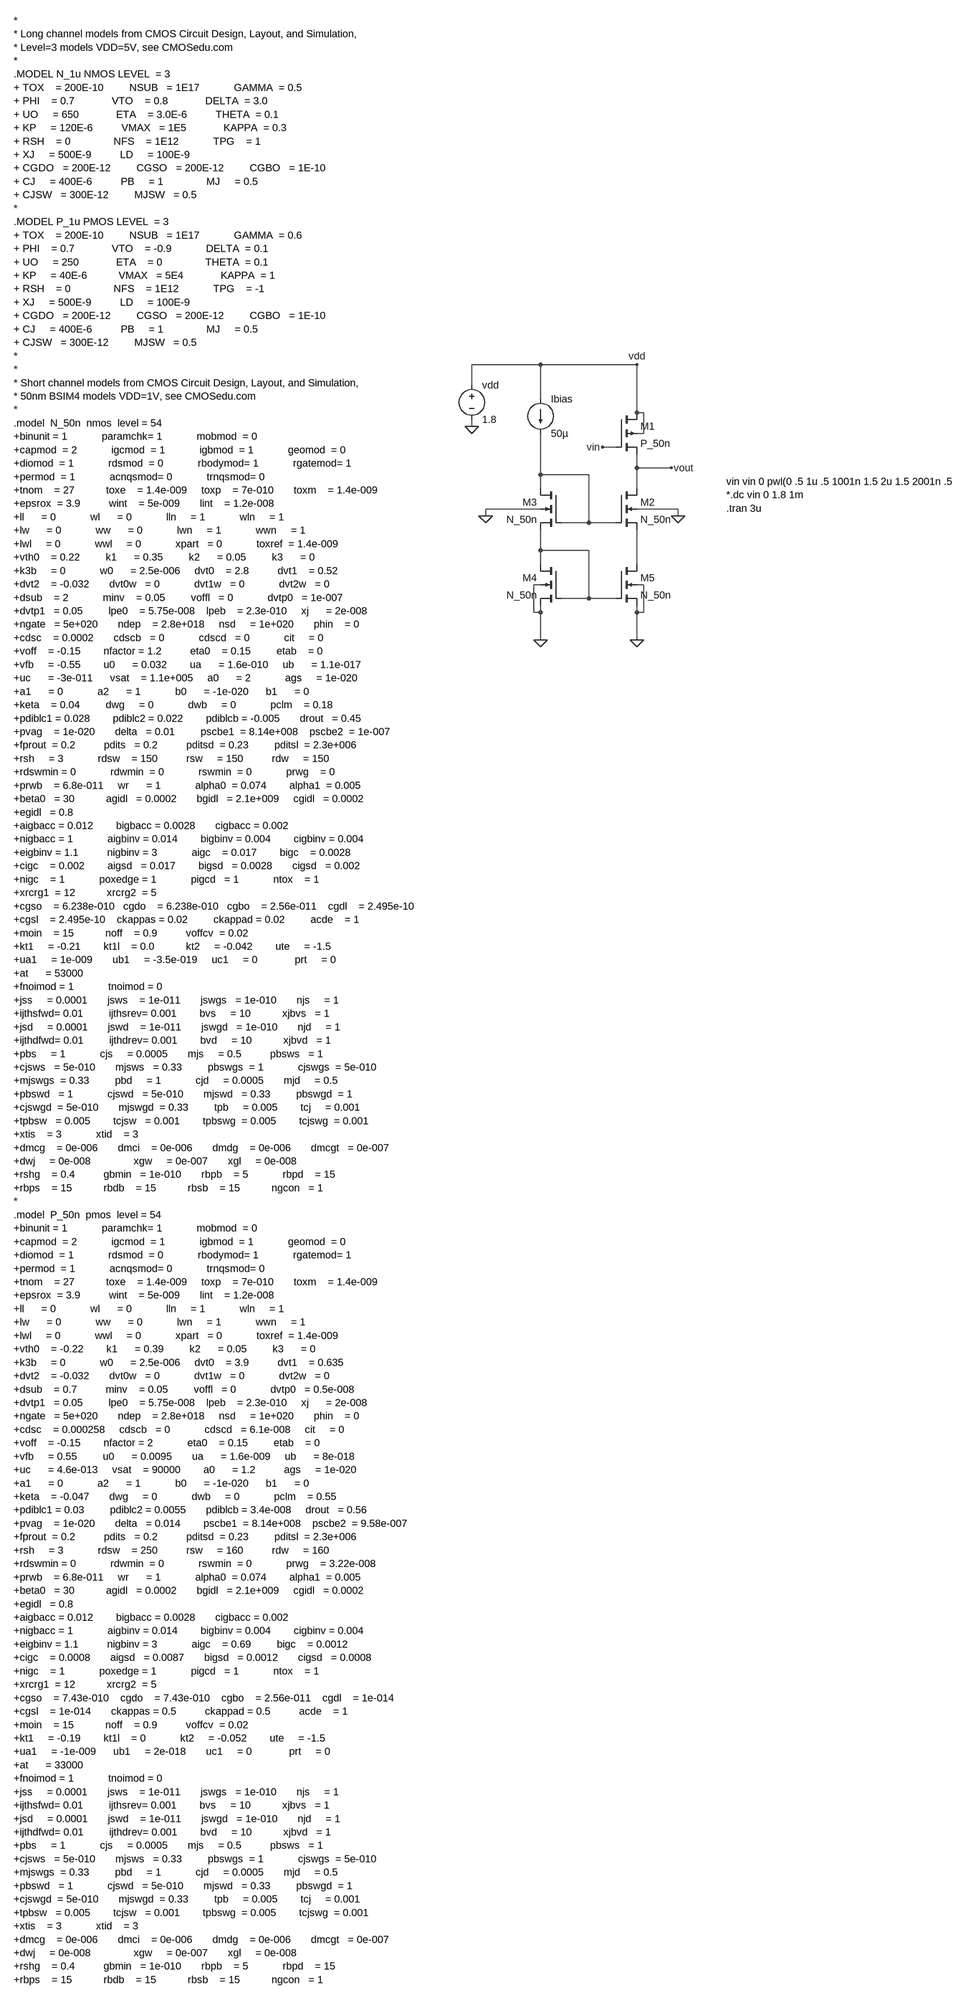
[diagram p0: schematic cascode-ac.asc]
cascode-ac.asc, the LTspice schematic file:
Version 4
SHEET 1 1216 3272
WIRE 48 -32 -112 -32
WIRE 272 -32 48 -32
WIRE -112 16 -112 -32
WIRE 48 48 48 -32
WIRE 272 80 272 -32
WIRE 288 80 272 80
WIRE -112 112 -112 96
WIRE 288 128 288 80
WIRE 288 128 272 128
WIRE 224 160 192 160
WIRE 272 208 272 176
WIRE 352 208 272 208
WIRE 48 224 48 128
WIRE 160 224 48 224
WIRE 48 256 48 224
WIRE 272 256 272 208
WIRE 48 304 -80 304
WIRE 368 304 272 304
WIRE -80 320 -80 304
WIRE 368 320 368 304
WIRE 160 336 160 224
WIRE 160 336 96 336
WIRE 224 336 160 336
WIRE 48 400 48 352
WIRE 160 400 48 400
WIRE 48 432 48 400
WIRE 272 432 272 352
WIRE 48 480 32 480
WIRE 288 480 272 480
WIRE 160 512 160 400
WIRE 160 512 96 512
WIRE 224 512 160 512
WIRE 32 544 32 480
WIRE 48 544 48 528
WIRE 48 544 32 544
WIRE 272 544 272 528
WIRE 288 544 288 480
WIRE 288 544 272 544
WIRE 48 608 48 544
WIRE 272 608 272 544
FLAG 48 608 0
FLAG 272 608 0
FLAG 352 208 vout
FLAG 272 -32 vdd
FLAG 192 160 vin
FLAG -112 112 0
FLAG 368 320 0
FLAG -80 320 0
SYMBOL pmos4 224 80 R0
SYMATTR InstName M1
SYMATTR Value P_50n
SYMBOL nmos4 224 256 R0
SYMATTR InstName M2
SYMATTR Value N_50n
SYMBOL nmos4 96 256 M0
SYMATTR InstName M3
SYMATTR Value N_50n
SYMBOL nmos4 96 432 M0
SYMATTR InstName M4
SYMATTR Value N_50n
SYMBOL nmos4 224 432 R0
SYMATTR InstName M5
SYMATTR Value N_50n
SYMBOL voltage -112 0 R0
SYMATTR InstName vdd
SYMATTR Value 1.8
SYMBOL current 48 48 R0
WINDOW 123 0 0 Left 2
WINDOW 39 0 0 Left 2
SYMATTR InstName Ibias
SYMATTR Value 50µ
TEXT -1528 -832 Left 2 !*\n* Long channel models from CMOS Circuit Design, Layout, and Simulation,\n* Level=3 models VDD=5V, see CMOSedu.com\n*                                                                   \n.MODEL N_1u NMOS LEVEL  = 3                  \n+ TOX    = 200E-10         NSUB   = 1E17            GAMMA  = 0.5          \n+ PHI    = 0.7             VTO    = 0.8             DELTA  = 3.0         \n+ UO     = 650             ETA    = 3.0E-6          THETA  = 0.1          \n+ KP     = 120E-6          VMAX   = 1E5             KAPPA  = 0.3                \n+ RSH    = 0               NFS    = 1E12            TPG    = 1                  \n+ XJ     = 500E-9          LD     = 100E-9                 \n+ CGDO   = 200E-12         CGSO   = 200E-12         CGBO   = 1E-10              \n+ CJ     = 400E-6          PB     = 1               MJ     = 0.5           \n+ CJSW   = 300E-12         MJSW   = 0.5                                  \n*                                                                               \n.MODEL P_1u PMOS LEVEL  = 3                  \n+ TOX    = 200E-10         NSUB   = 1E17            GAMMA  = 0.6          \n+ PHI    = 0.7             VTO    = -0.9            DELTA  = 0.1          \n+ UO     = 250             ETA    = 0               THETA  = 0.1         \n+ KP     = 40E-6           VMAX   = 5E4             KAPPA  = 1         \n+ RSH    = 0               NFS    = 1E12            TPG    = -1                 \n+ XJ     = 500E-9          LD     = 100E-9               \n+ CGDO   = 200E-12         CGSO   = 200E-12         CGBO   = 1E-10              \n+ CJ     = 400E-6          PB     = 1               MJ     = 0.5                \n+ CJSW   = 300E-12         MJSW   = 0.5   \n*\n*\n* Short channel models from CMOS Circuit Design, Layout, and Simulation,\n* 50nm BSIM4 models VDD=1V, see CMOSedu.com\n*\n.model  N_50n  nmos  level = 54\n+binunit = 1            paramchk= 1            mobmod  = 0          \n+capmod  = 2            igcmod  = 1            igbmod  = 1            geomod  = 0          \n+diomod  = 1            rdsmod  = 0            rbodymod= 1            rgatemod= 1          \n+permod  = 1            acnqsmod= 0            trnqsmod= 0          \n+tnom    = 27           toxe    = 1.4e-009     toxp    = 7e-010       toxm    = 1.4e-009   \n+epsrox  = 3.9          wint    = 5e-009       lint    = 1.2e-008   \n+ll      = 0            wl      = 0            lln     = 1            wln     = 1          \n+lw      = 0            ww      = 0            lwn     = 1            wwn     = 1          \n+lwl     = 0            wwl     = 0            xpart   = 0            toxref  = 1.4e-009   \n+vth0    = 0.22         k1      = 0.35         k2      = 0.05         k3      = 0          \n+k3b     = 0            w0      = 2.5e-006     dvt0    = 2.8          dvt1    = 0.52       \n+dvt2    = -0.032       dvt0w   = 0            dvt1w   = 0            dvt2w   = 0          \n+dsub    = 2            minv    = 0.05         voffl   = 0            dvtp0   = 1e-007     \n+dvtp1   = 0.05         lpe0    = 5.75e-008    lpeb    = 2.3e-010     xj      = 2e-008     \n+ngate   = 5e+020       ndep    = 2.8e+018     nsd     = 1e+020       phin    = 0          \n+cdsc    = 0.0002       cdscb   = 0            cdscd   = 0            cit     = 0          \n+voff    = -0.15        nfactor = 1.2          eta0    = 0.15         etab    = 0          \n+vfb     = -0.55        u0      = 0.032        ua      = 1.6e-010     ub      = 1.1e-017   \n+uc      = -3e-011      vsat    = 1.1e+005     a0      = 2            ags     = 1e-020     \n+a1      = 0            a2      = 1            b0      = -1e-020      b1      = 0          \n+keta    = 0.04         dwg     = 0            dwb     = 0            pclm    = 0.18       \n+pdiblc1 = 0.028        pdiblc2 = 0.022        pdiblcb = -0.005       drout   = 0.45       \n+pvag    = 1e-020       delta   = 0.01         pscbe1  = 8.14e+008    pscbe2  = 1e-007     \n+fprout  = 0.2          pdits   = 0.2          pditsd  = 0.23         pditsl  = 2.3e+006   \n+rsh     = 3            rdsw    = 150          rsw     = 150          rdw     = 150        \n+rdswmin = 0            rdwmin  = 0            rswmin  = 0            prwg    = 0          \n+prwb    = 6.8e-011     wr      = 1            alpha0  = 0.074        alpha1  = 0.005      \n+beta0   = 30           agidl   = 0.0002       bgidl   = 2.1e+009     cgidl   = 0.0002     \n+egidl   = 0.8          \n+aigbacc = 0.012        bigbacc = 0.0028       cigbacc = 0.002\n+nigbacc = 1            aigbinv = 0.014        bigbinv = 0.004        cigbinv = 0.004\n+eigbinv = 1.1          nigbinv = 3            aigc    = 0.017        bigc    = 0.0028\n+cigc    = 0.002        aigsd   = 0.017        bigsd   = 0.0028       cigsd   = 0.002\n+nigc    = 1            poxedge = 1            pigcd   = 1            ntox    = 1\n+xrcrg1  = 12           xrcrg2  = 5          \n+cgso    = 6.238e-010   cgdo    = 6.238e-010   cgbo    = 2.56e-011    cgdl    = 2.495e-10     \n+cgsl    = 2.495e-10    ckappas = 0.02         ckappad = 0.02         acde    = 1          \n+moin    = 15           noff    = 0.9          voffcv  = 0.02       \n+kt1     = -0.21        kt1l    = 0.0           kt2     = -0.042        ute     = -1.5\n+ua1     = 1e-009       ub1     = -3.5e-019     uc1     = 0             prt     = 0\n+at      = 53000\n+fnoimod = 1            tnoimod = 0          \n+jss     = 0.0001       jsws    = 1e-011       jswgs   = 1e-010       njs     = 1          \n+ijthsfwd= 0.01         ijthsrev= 0.001        bvs     = 10           xjbvs   = 1          \n+jsd     = 0.0001       jswd    = 1e-011       jswgd   = 1e-010       njd     = 1          \n+ijthdfwd= 0.01         ijthdrev= 0.001        bvd     = 10           xjbvd   = 1          \n+pbs     = 1            cjs     = 0.0005       mjs     = 0.5          pbsws   = 1          \n+cjsws   = 5e-010       mjsws   = 0.33         pbswgs  = 1            cjswgs  = 5e-010     \n+mjswgs  = 0.33         pbd     = 1            cjd     = 0.0005       mjd     = 0.5        \n+pbswd   = 1            cjswd   = 5e-010       mjswd   = 0.33         pbswgd  = 1          \n+cjswgd  = 5e-010       mjswgd  = 0.33         tpb     = 0.005        tcj     = 0.001      \n+tpbsw   = 0.005        tcjsw   = 0.001        tpbswg  = 0.005        tcjswg  = 0.001      \n+xtis    = 3            xtid    = 3          \n+dmcg    = 0e-006       dmci    = 0e-006       dmdg    = 0e-006       dmcgt   = 0e-007     \n+dwj     = 0e-008               xgw     = 0e-007       xgl     = 0e-008     \n+rshg    = 0.4          gbmin   = 1e-010       rbpb    = 5            rbpd    = 15         \n+rbps    = 15           rbdb    = 15           rbsb    = 15           ngcon   = 1\n*\n.model  P_50n  pmos  level = 54\n+binunit = 1            paramchk= 1            mobmod  = 0          \n+capmod  = 2            igcmod  = 1            igbmod  = 1            geomod  = 0          \n+diomod  = 1            rdsmod  = 0            rbodymod= 1            rgatemod= 1          \n+permod  = 1            acnqsmod= 0            trnqsmod= 0          \n+tnom    = 27           toxe    = 1.4e-009     toxp    = 7e-010       toxm    = 1.4e-009   \n+epsrox  = 3.9          wint    = 5e-009       lint    = 1.2e-008   \n+ll      = 0            wl      = 0            lln     = 1            wln     = 1          \n+lw      = 0            ww      = 0            lwn     = 1            wwn     = 1          \n+lwl     = 0            wwl     = 0            xpart   = 0            toxref  = 1.4e-009   \n+vth0    = -0.22        k1      = 0.39         k2      = 0.05         k3      = 0          \n+k3b     = 0            w0      = 2.5e-006     dvt0    = 3.9          dvt1    = 0.635        \n+dvt2    = -0.032       dvt0w   = 0            dvt1w   = 0            dvt2w   = 0          \n+dsub    = 0.7          minv    = 0.05         voffl   = 0            dvtp0   = 0.5e-008     \n+dvtp1   = 0.05         lpe0    = 5.75e-008    lpeb    = 2.3e-010     xj      = 2e-008     \n+ngate   = 5e+020       ndep    = 2.8e+018     nsd     = 1e+020       phin    = 0          \n+cdsc    = 0.000258     cdscb   = 0            cdscd   = 6.1e-008     cit     = 0          \n+voff    = -0.15        nfactor = 2            eta0    = 0.15         etab    = 0          \n+vfb     = 0.55         u0      = 0.0095       ua      = 1.6e-009     ub      = 8e-018     \n+uc      = 4.6e-013     vsat    = 90000        a0      = 1.2          ags     = 1e-020     \n+a1      = 0            a2      = 1            b0      = -1e-020      b1      = 0          \n+keta    = -0.047       dwg     = 0            dwb     = 0            pclm    = 0.55       \n+pdiblc1 = 0.03         pdiblc2 = 0.0055       pdiblcb = 3.4e-008     drout   = 0.56       \n+pvag    = 1e-020       delta   = 0.014        pscbe1  = 8.14e+008    pscbe2  = 9.58e-007  \n+fprout  = 0.2          pdits   = 0.2          pditsd  = 0.23         pditsl  = 2.3e+006   \n+rsh     = 3            rdsw    = 250          rsw     = 160          rdw     = 160        \n+rdswmin = 0            rdwmin  = 0            rswmin  = 0            prwg    = 3.22e-008  \n+prwb    = 6.8e-011     wr      = 1            alpha0  = 0.074        alpha1  = 0.005      \n+beta0   = 30           agidl   = 0.0002       bgidl   = 2.1e+009     cgidl   = 0.0002     \n+egidl   = 0.8          \n+aigbacc = 0.012        bigbacc = 0.0028       cigbacc = 0.002\n+nigbacc = 1            aigbinv = 0.014        bigbinv = 0.004        cigbinv = 0.004\n+eigbinv = 1.1          nigbinv = 3            aigc    = 0.69         bigc    = 0.0012\n+cigc    = 0.0008       aigsd   = 0.0087       bigsd   = 0.0012       cigsd   = 0.0008\n+nigc    = 1            poxedge = 1            pigcd   = 1            ntox    = 1\n+xrcrg1  = 12           xrcrg2  = 5          \n+cgso    = 7.43e-010    cgdo    = 7.43e-010    cgbo    = 2.56e-011    cgdl    = 1e-014     \n+cgsl    = 1e-014       ckappas = 0.5          ckappad = 0.5          acde    = 1          \n+moin    = 15           noff    = 0.9          voffcv  = 0.02       \n+kt1     = -0.19        kt1l    = 0            kt2     = -0.052        ute     = -1.5\n+ua1     = -1e-009      ub1     = 2e-018       uc1     = 0             prt     = 0\n+at      = 33000\n+fnoimod = 1            tnoimod = 0          \n+jss     = 0.0001       jsws    = 1e-011       jswgs   = 1e-010       njs     = 1          \n+ijthsfwd= 0.01         ijthsrev= 0.001        bvs     = 10           xjbvs   = 1          \n+jsd     = 0.0001       jswd    = 1e-011       jswgd   = 1e-010       njd     = 1          \n+ijthdfwd= 0.01         ijthdrev= 0.001        bvd     = 10           xjbvd   = 1          \n+pbs     = 1            cjs     = 0.0005       mjs     = 0.5          pbsws   = 1          \n+cjsws   = 5e-010       mjsws   = 0.33         pbswgs  = 1            cjswgs  = 5e-010     \n+mjswgs  = 0.33         pbd     = 1            cjd     = 0.0005       mjd     = 0.5        \n+pbswd   = 1            cjswd   = 5e-010       mjswd   = 0.33         pbswgd  = 1          \n+cjswgd  = 5e-010       mjswgd  = 0.33         tpb     = 0.005        tcj     = 0.001      \n+tpbsw   = 0.005        tcjsw   = 0.001        tpbswg  = 0.005        tcjswg  = 0.001      \n+xtis    = 3            xtid    = 3          \n+dmcg    = 0e-006       dmci    = 0e-006       dmdg    = 0e-006       dmcgt   = 0e-007     \n+dwj     = 0e-008               xgw     = 0e-007       xgl     = 0e-008     \n+rshg    = 0.4          gbmin   = 1e-010       rbpb    = 5            rbpd    = 15         \n+rbps    = 15           rbdb    = 15           rbsb    = 15           ngcon   = 1
TEXT 480 240 Left 2 !vin vin 0 pwl(0 .5 1u .5 1001n 1.5 2u 1.5 2001n .5\n*.dc vin 0 1.8 1m\n.tran 3u

The netlist it stands for:
* cascode-ac.asc
M1 vdd vin vout vdd P_50n
M2 vout N001 N003 0 N_50n
M3 N001 N001 N002 0 N_50n
M4 N002 N002 0 0 N_50n
M5 N003 N002 0 0 N_50n
vdd vdd 0 1.8
Ibias vdd N001 50µ
.model NMOS NMOS
.model PMOS PMOS
.lib standard.mos
*
* Long channel models from CMOS Circuit Design, Layout, and Simulation,
* Level=3 models VDD=5V, see CMOSedu.com
*
.MODEL N_1u NMOS LEVEL  = 3
+ TOX    = 200E-10         NSUB   = 1E17            GAMMA  = 0.5
+ PHI    = 0.7             VTO    = 0.8             DELTA  = 3.0
+ UO     = 650             ETA    = 3.0E-6          THETA  = 0.1
+ KP     = 120E-6          VMAX   = 1E5             KAPPA  = 0.3
+ RSH    = 0               NFS    = 1E12            TPG    = 1
+ XJ     = 500E-9          LD     = 100E-9
+ CGDO   = 200E-12         CGSO   = 200E-12         CGBO   = 1E-10
+ CJ     = 400E-6          PB     = 1               MJ     = 0.5
+ CJSW   = 300E-12         MJSW   = 0.5
*
.MODEL P_1u PMOS LEVEL  = 3
+ TOX    = 200E-10         NSUB   = 1E17            GAMMA  = 0.6
+ PHI    = 0.7             VTO    = -0.9            DELTA  = 0.1
+ UO     = 250             ETA    = 0               THETA  = 0.1
+ KP     = 40E-6           VMAX   = 5E4             KAPPA  = 1
+ RSH    = 0               NFS    = 1E12            TPG    = -1
+ XJ     = 500E-9          LD     = 100E-9
+ CGDO   = 200E-12         CGSO   = 200E-12         CGBO   = 1E-10
+ CJ     = 400E-6          PB     = 1               MJ     = 0.5
+ CJSW   = 300E-12         MJSW   = 0.5
*
*
* Short channel models from CMOS Circuit Design, Layout, and Simulation,
* 50nm BSIM4 models VDD=1V, see CMOSedu.com
*
.model  N_50n  nmos  level = 54
+binunit = 1            paramchk= 1            mobmod  = 0
+capmod  = 2            igcmod  = 1            igbmod  = 1            geomod  = 0
+diomod  = 1            rdsmod  = 0            rbodymod= 1            rgatemod= 1
+permod  = 1            acnqsmod= 0            trnqsmod= 0
+tnom    = 27           toxe    = 1.4e-009     toxp    = 7e-010       toxm    = 1.4e-009
+epsrox  = 3.9          wint    = 5e-009       lint    = 1.2e-008
+ll      = 0            wl      = 0            lln     = 1            wln     = 1
+lw      = 0            ww      = 0            lwn     = 1            wwn     = 1
+lwl     = 0            wwl     = 0            xpart   = 0            toxref  = 1.4e-009
+vth0    = 0.22         k1      = 0.35         k2      = 0.05         k3      = 0
+k3b     = 0            w0      = 2.5e-006     dvt0    = 2.8          dvt1    = 0.52
+dvt2    = -0.032       dvt0w   = 0            dvt1w   = 0            dvt2w   = 0
+dsub    = 2            minv    = 0.05         voffl   = 0            dvtp0   = 1e-007
+dvtp1   = 0.05         lpe0    = 5.75e-008    lpeb    = 2.3e-010     xj      = 2e-008
+ngate   = 5e+020       ndep    = 2.8e+018     nsd     = 1e+020       phin    = 0
+cdsc    = 0.0002       cdscb   = 0            cdscd   = 0            cit     = 0
+voff    = -0.15        nfactor = 1.2          eta0    = 0.15         etab    = 0
+vfb     = -0.55        u0      = 0.032        ua      = 1.6e-010     ub      = 1.1e-017
+uc      = -3e-011      vsat    = 1.1e+005     a0      = 2            ags     = 1e-020
+a1      = 0            a2      = 1            b0      = -1e-020      b1      = 0
+keta    = 0.04         dwg     = 0            dwb     = 0            pclm    = 0.18
+pdiblc1 = 0.028        pdiblc2 = 0.022        pdiblcb = -0.005       drout   = 0.45
+pvag    = 1e-020       delta   = 0.01         pscbe1  = 8.14e+008    pscbe2  = 1e-007
+fprout  = 0.2          pdits   = 0.2          pditsd  = 0.23         pditsl  = 2.3e+006
+rsh     = 3            rdsw    = 150          rsw     = 150          rdw     = 150
+rdswmin = 0            rdwmin  = 0            rswmin  = 0            prwg    = 0
+prwb    = 6.8e-011     wr      = 1            alpha0  = 0.074        alpha1  = 0.005
+beta0   = 30           agidl   = 0.0002       bgidl   = 2.1e+009     cgidl   = 0.0002
+egidl   = 0.8
+aigbacc = 0.012        bigbacc = 0.0028       cigbacc = 0.002
+nigbacc = 1            aigbinv = 0.014        bigbinv = 0.004        cigbinv = 0.004
+eigbinv = 1.1          nigbinv = 3            aigc    = 0.017        bigc    = 0.0028
+cigc    = 0.002        aigsd   = 0.017        bigsd   = 0.0028       cigsd   = 0.002
+nigc    = 1            poxedge = 1            pigcd   = 1            ntox    = 1
+xrcrg1  = 12           xrcrg2  = 5
+cgso    = 6.238e-010   cgdo    = 6.238e-010   cgbo    = 2.56e-011    cgdl    = 2.495e-10
+cgsl    = 2.495e-10    ckappas = 0.02         ckappad = 0.02         acde    = 1
+moin    = 15           noff    = 0.9          voffcv  = 0.02
+kt1     = -0.21        kt1l    = 0.0           kt2     = -0.042        ute     = -1.5
+ua1     = 1e-009       ub1     = -3.5e-019     uc1     = 0             prt     = 0
+at      = 53000
+fnoimod = 1            tnoimod = 0
+jss     = 0.0001       jsws    = 1e-011       jswgs   = 1e-010       njs     = 1
+ijthsfwd= 0.01         ijthsrev= 0.001        bvs     = 10           xjbvs   = 1
+jsd     = 0.0001       jswd    = 1e-011       jswgd   = 1e-010       njd     = 1
+ijthdfwd= 0.01         ijthdrev= 0.001        bvd     = 10           xjbvd   = 1
+pbs     = 1            cjs     = 0.0005       mjs     = 0.5          pbsws   = 1
+cjsws   = 5e-010       mjsws   = 0.33         pbswgs  = 1            cjswgs  = 5e-010
+mjswgs  = 0.33         pbd     = 1            cjd     = 0.0005       mjd     = 0.5
+pbswd   = 1            cjswd   = 5e-010       mjswd   = 0.33         pbswgd  = 1
+cjswgd  = 5e-010       mjswgd  = 0.33         tpb     = 0.005        tcj     = 0.001
+tpbsw   = 0.005        tcjsw   = 0.001        tpbswg  = 0.005        tcjswg  = 0.001
+xtis    = 3            xtid    = 3
+dmcg    = 0e-006       dmci    = 0e-006       dmdg    = 0e-006       dmcgt   = 0e-007
+dwj     = 0e-008               xgw     = 0e-007       xgl     = 0e-008
+rshg    = 0.4          gbmin   = 1e-010       rbpb    = 5            rbpd    = 15
+rbps    = 15           rbdb    = 15           rbsb    = 15           ngcon   = 1
*
.model  P_50n  pmos  level = 54
+binunit = 1            paramchk= 1            mobmod  = 0
+capmod  = 2            igcmod  = 1            igbmod  = 1            geomod  = 0
+diomod  = 1            rdsmod  = 0            rbodymod= 1            rgatemod= 1
+permod  = 1            acnqsmod= 0            trnqsmod= 0
+tnom    = 27           toxe    = 1.4e-009     toxp    = 7e-010       toxm    = 1.4e-009
+epsrox  = 3.9          wint    = 5e-009       lint    = 1.2e-008
+ll      = 0            wl      = 0            lln     = 1            wln     = 1
+lw      = 0            ww      = 0            lwn     = 1            wwn     = 1
+lwl     = 0            wwl     = 0            xpart   = 0            toxref  = 1.4e-009
+vth0    = -0.22        k1      = 0.39         k2      = 0.05         k3      = 0
+k3b     = 0            w0      = 2.5e-006     dvt0    = 3.9          dvt1    = 0.635
+dvt2    = -0.032       dvt0w   = 0            dvt1w   = 0            dvt2w   = 0
+dsub    = 0.7          minv    = 0.05         voffl   = 0            dvtp0   = 0.5e-008
+dvtp1   = 0.05         lpe0    = 5.75e-008    lpeb    = 2.3e-010     xj      = 2e-008
+ngate   = 5e+020       ndep    = 2.8e+018     nsd     = 1e+020       phin    = 0
+cdsc    = 0.000258     cdscb   = 0            cdscd   = 6.1e-008     cit     = 0
+voff    = -0.15        nfactor = 2            eta0    = 0.15         etab    = 0
+vfb     = 0.55         u0      = 0.0095       ua      = 1.6e-009     ub      = 8e-018
+uc      = 4.6e-013     vsat    = 90000        a0      = 1.2          ags     = 1e-020
+a1      = 0            a2      = 1            b0      = -1e-020      b1      = 0
+keta    = -0.047       dwg     = 0            dwb     = 0            pclm    = 0.55
+pdiblc1 = 0.03         pdiblc2 = 0.0055       pdiblcb = 3.4e-008     drout   = 0.56
+pvag    = 1e-020       delta   = 0.014        pscbe1  = 8.14e+008    pscbe2  = 9.58e-007
+fprout  = 0.2          pdits   = 0.2          pditsd  = 0.23         pditsl  = 2.3e+006
+rsh     = 3            rdsw    = 250          rsw     = 160          rdw     = 160
+rdswmin = 0            rdwmin  = 0            rswmin  = 0            prwg    = 3.22e-008
+prwb    = 6.8e-011     wr      = 1            alpha0  = 0.074        alpha1  = 0.005
+beta0   = 30           agidl   = 0.0002       bgidl   = 2.1e+009     cgidl   = 0.0002
+egidl   = 0.8
+aigbacc = 0.012        bigbacc = 0.0028       cigbacc = 0.002
+nigbacc = 1            aigbinv = 0.014        bigbinv = 0.004        cigbinv = 0.004
+eigbinv = 1.1          nigbinv = 3            aigc    = 0.69         bigc    = 0.0012
+cigc    = 0.0008       aigsd   = 0.0087       bigsd   = 0.0012       cigsd   = 0.0008
+nigc    = 1            poxedge = 1            pigcd   = 1            ntox    = 1
+xrcrg1  = 12           xrcrg2  = 5
+cgso    = 7.43e-010    cgdo    = 7.43e-010    cgbo    = 2.56e-011    cgdl    = 1e-014
+cgsl    = 1e-014       ckappas = 0.5          ckappad = 0.5          acde    = 1
+moin    = 15           noff    = 0.9          voffcv  = 0.02
+kt1     = -0.19        kt1l    = 0            kt2     = -0.052        ute     = -1.5
+ua1     = -1e-009      ub1     = 2e-018       uc1     = 0             prt     = 0
+at      = 33000
+fnoimod = 1            tnoimod = 0
+jss     = 0.0001       jsws    = 1e-011       jswgs   = 1e-010       njs     = 1
+ijthsfwd= 0.01         ijthsrev= 0.001        bvs     = 10           xjbvs   = 1
+jsd     = 0.0001       jswd    = 1e-011       jswgd   = 1e-010       njd     = 1
+ijthdfwd= 0.01         ijthdrev= 0.001        bvd     = 10           xjbvd   = 1
+pbs     = 1            cjs     = 0.0005       mjs     = 0.5          pbsws   = 1
+cjsws   = 5e-010       mjsws   = 0.33         pbswgs  = 1            cjswgs  = 5e-010
+mjswgs  = 0.33         pbd     = 1            cjd     = 0.0005       mjd     = 0.5
+pbswd   = 1            cjswd   = 5e-010       mjswd   = 0.33         pbswgd  = 1
+cjswgd  = 5e-010       mjswgd  = 0.33         tpb     = 0.005        tcj     = 0.001
+tpbsw   = 0.005        tcjsw   = 0.001        tpbswg  = 0.005        tcjswg  = 0.001
+xtis    = 3            xtid    = 3
+dmcg    = 0e-006       dmci    = 0e-006       dmdg    = 0e-006       dmcgt   = 0e-007
+dwj     = 0e-008               xgw     = 0e-007       xgl     = 0e-008
+rshg    = 0.4          gbmin   = 1e-010       rbpb    = 5            rbpd    = 15
+rbps    = 15           rbdb    = 15           rbsb    = 15           ngcon   = 1
vin vin 0 pwl(0 .5 1u .5 1001n 1.5 2u 1.5 2001n .5
*.dc vin 0 1.8 1m
.tran 3u
.backanno
.end